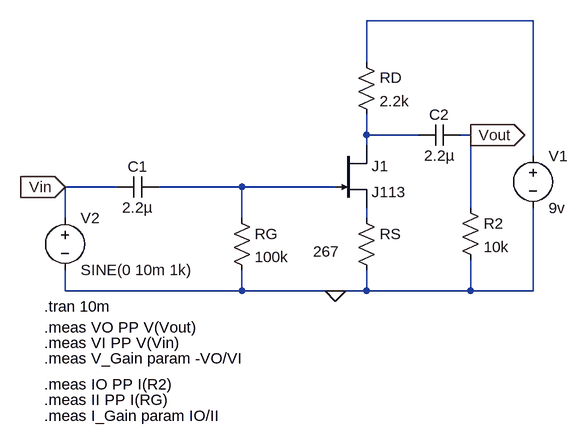
[diagram p0: schematic PrePreAmp.asc]
PrePreAmp.asc, the LTspice schematic file:
Version 4.1
SHEET 1 880 680
WIRE 528 -416 272 -416
WIRE 272 -352 272 -416
WIRE 272 -240 272 -272
WIRE 352 -240 272 -240
WIRE 432 -240 416 -240
WIRE 272 -224 272 -240
WIRE 528 -208 528 -416
WIRE -112 -160 -192 -160
WIRE 80 -160 -48 -160
WIRE 224 -160 80 -160
WIRE 432 -128 432 -240
WIRE -192 -112 -192 -160
WIRE 80 -112 80 -160
WIRE 272 -112 272 -128
WIRE -192 0 -192 -32
WIRE 80 0 80 -32
WIRE 80 0 -192 0
WIRE 224 0 80 0
WIRE 272 0 272 -32
WIRE 272 0 224 0
WIRE 432 0 432 -48
WIRE 432 0 272 0
WIRE 528 0 528 -128
WIRE 528 0 432 0
FLAG 224 0 0
FLAG -192 -160 Vin
IOPIN -192 -160 In
FLAG 432 -240 Vout
IOPIN 432 -240 Out
SYMBOL njf 224 -224 R0
SYMATTR InstName J1
SYMATTR Value J113
SYMBOL res 256 -368 R0
SYMATTR InstName RD
SYMATTR Value 2.2k
SYMBOL voltage 528 -224 R0
WINDOW 123 0 0 Left 0
WINDOW 39 0 0 Left 0
SYMATTR InstName V1
SYMATTR Value 9v
SYMBOL voltage -192 -128 R0
WINDOW 123 0 0 Left 0
WINDOW 39 0 0 Left 0
SYMATTR InstName V2
SYMATTR Value SINE(0 10m 1k)
SYMBOL cap -48 -176 R90
WINDOW 0 0 32 VBottom 2
WINDOW 3 32 32 VTop 2
SYMATTR InstName C1
SYMATTR Value 2.2µ
SYMBOL cap 416 -256 R90
WINDOW 0 0 32 VBottom 2
WINDOW 3 32 32 VTop 2
SYMATTR InstName C2
SYMATTR Value 2.2µ
SYMBOL res 416 -144 R0
SYMATTR InstName R2
SYMATTR Value 10k
SYMBOL res 256 -128 R0
WINDOW 3 -66 67 Left 2
SYMATTR InstName RS
SYMATTR Value 267
SYMBOL res 64 -128 R0
SYMATTR InstName RG
SYMATTR Value 100k
TEXT -224 24 Left 2 !.tran 10m
TEXT -224 56 Left 2 !.meas VO PP V(Vout)
TEXT -224 80 Left 2 !.meas VI PP V(Vin)
TEXT -224 104 Left 2 !.meas V_Gain param -VO/VI
TEXT -224 144 Left 2 !.meas IO PP I(R2)
TEXT -224 168 Left 2 !.meas II PP I(RG)
TEXT -224 192 Left 2 !.meas I_Gain param IO/II

The netlist it stands for:
* PrePreAmp.asc
J1 N002 N003 N004 J113
RD N001 N002 2.2k
V1 N001 0 9v
V2 Vin 0 SINE(0 10m 1k)
C1 N003 Vin 2.2µ
C2 Vout N002 2.2µ
R2 Vout 0 10k
RS N004 0 267
RG N003 0 100k
.model NJF NJF
.model PJF PJF
.lib standard.jft
.tran 10m
.meas VO PP V(Vout)
.meas VI PP V(Vin)
.meas V_Gain param -VO/VI
.meas IO PP I(R2)
.meas II PP I(RG)
.meas I_Gain param IO/II
.backanno
.end